# Altium project BMI270_breakout.PrjPcb
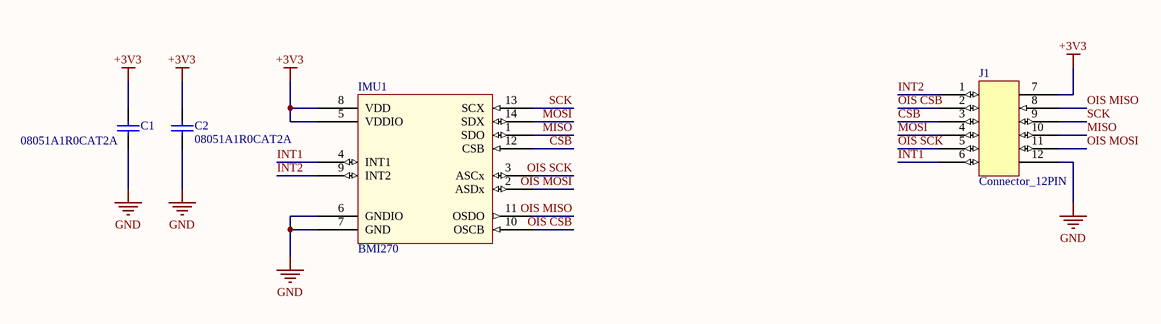
[diagram p0: Sheet1.SchDoc]
1 sheet, 4 parts. Net scope: global (net labels, ports and power ports of the same name join across sheets).
Board file: PCB1.PcbDoc

## Sheet Sheet1.SchDoc
size A4; SheetNumber: 1; SheetTotal: 1

### Parts
C1  08051A1R0CAT2A  [CAPC2013X140X50ML20T25]
C2  08051A1R0CAT2A  [CAPC2013X140X50ML20T25]
IMU1  BMI270  [LGA14_3x2.5x0.8mm]
J1  Connector_12PIN  [12PIN_connector]

### Nets
+3V3: C1.2 C2.2 IMU1.5(VDDIO) IMU1.8(VDD) J1.7
GND: C1.1 C2.1 IMU1.6(GNDIO) IMU1.7(GND) J1.12
CSB: IMU1.12(CSB) J1.3
INT1: IMU1.4(INT1) J1.6
INT2: IMU1.9(INT2) J1.1
MISO: IMU1.1(SDO) J1.10
MOSI: IMU1.14(SDX) J1.4
OIS CSB: IMU1.10(OSCB) J1.2
OIS MISO: IMU1.11(OSDO) J1.8
OIS MOSI: IMU1.2(ASDx) J1.11
OIS SCK: IMU1.3(ASCx) J1.5
SCK: IMU1.13(SCX) J1.9

### Library data of the parts
C1 C2 = CMP-2007-04534-1: Manufacturer: AVX Interconnect / Elco; Part Number: 08051A1R0CAT2A